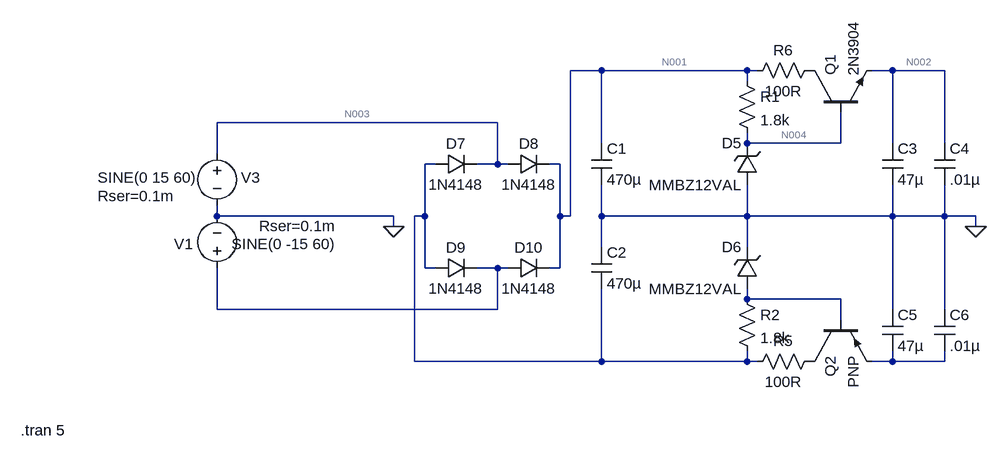
[diagram p0: schematic Mu-Tron Phasor II Power Supply.asc]
Mu-Tron Phasor II Power Supply.asc, the LTspice schematic file:
Version 4
SHEET 1 1000 680
WIRE -48 0 -96 0
WIRE 176 0 -48 0
WIRE 192 0 176 0
WIRE 400 0 368 0
WIRE 480 0 400 0
WIRE 176 16 176 0
WIRE -208 80 -640 80
WIRE -48 112 -48 0
WIRE 176 112 176 96
WIRE 320 112 320 64
WIRE 320 112 176 112
WIRE 400 112 400 0
WIRE 480 112 480 0
WIRE -640 128 -640 80
WIRE -304 144 -320 144
WIRE -208 144 -208 80
WIRE -208 144 -240 144
WIRE -192 144 -208 144
WIRE -112 144 -128 144
WIRE -640 224 -640 208
WIRE -368 224 -640 224
WIRE -320 224 -320 144
WIRE -320 224 -336 224
WIRE -112 224 -112 144
WIRE -96 224 -96 0
WIRE -96 224 -112 224
WIRE -48 224 -48 176
WIRE 176 224 176 176
WIRE 176 224 -48 224
WIRE 400 224 400 176
WIRE 400 224 176 224
WIRE 480 224 480 176
WIRE 480 224 400 224
WIRE 528 224 480 224
WIRE -368 240 -368 224
WIRE 528 240 528 224
WIRE -48 272 -48 224
WIRE 176 272 176 224
WIRE -320 304 -320 224
WIRE -304 304 -320 304
WIRE -208 304 -240 304
WIRE -192 304 -208 304
WIRE -112 304 -112 224
WIRE -112 304 -128 304
WIRE 176 352 176 336
WIRE 320 352 176 352
WIRE -640 368 -640 304
WIRE -208 368 -208 304
WIRE -208 368 -640 368
WIRE 400 368 400 224
WIRE 480 368 480 224
WIRE 320 384 320 352
WIRE -336 448 -336 224
WIRE -48 448 -48 336
WIRE -48 448 -336 448
WIRE 176 448 176 432
WIRE 176 448 -48 448
WIRE 192 448 176 448
WIRE 400 448 400 432
WIRE 400 448 368 448
WIRE 480 448 480 432
WIRE 480 448 400 448
FLAG -368 240 0
FLAG 528 240 0
SYMBOL cap -64 112 R0
SYMATTR InstName C1
SYMATTR Value 470µ
SYMBOL cap -64 272 R0
SYMATTR InstName C2
SYMATTR Value 470µ
SYMBOL zener 192 176 R180
WINDOW 0 24 64 Left 2
WINDOW 3 24 0 Left 2
SYMATTR InstName D5
SYMATTR Value MMBZ12VAL
SYMATTR Description Diode
SYMATTR Type diode
SYMBOL res 160 0 R0
SYMATTR InstName R1
SYMATTR Value 1.8k
SYMBOL zener 192 336 R180
WINDOW 0 24 64 Left 2
WINDOW 3 24 0 Left 2
SYMATTR InstName D6
SYMATTR Value MMBZ12VAL
SYMATTR Description Diode
SYMATTR Type diode
SYMBOL res 160 336 R0
SYMATTR InstName R2
SYMATTR Value 1.8k
SYMBOL voltage -640 112 R0
WINDOW 0 37 53 Left 2
WINDOW 3 -184 53 Left 2
WINDOW 123 0 0 Left 0
WINDOW 39 -184 81 Left 2
SYMATTR InstName V3
SYMATTR Value SINE(0 15 60)
SYMATTR SpiceLine Rser=0.1m
SYMBOL diode -304 160 R270
WINDOW 0 32 32 VTop 2
WINDOW 3 0 32 VBottom 2
SYMATTR InstName D7
SYMATTR Value 1N4148
SYMBOL diode -192 160 R270
WINDOW 0 32 32 VTop 2
WINDOW 3 0 32 VBottom 2
SYMATTR InstName D8
SYMATTR Value 1N4148
SYMBOL diode -304 320 R270
WINDOW 0 32 32 VTop 2
WINDOW 3 0 32 VBottom 2
SYMATTR InstName D9
SYMATTR Value 1N4148
SYMBOL diode -192 320 R270
WINDOW 0 32 32 VTop 2
WINDOW 3 0 32 VBottom 2
SYMATTR InstName D10
SYMATTR Value 1N4148
SYMBOL npn 272 64 R270
SYMATTR InstName Q1
SYMATTR Value 2N3904
SYMBOL cap 384 112 R0
SYMATTR InstName C3
SYMATTR Value 47µ
SYMBOL cap 464 112 R0
SYMATTR InstName C4
SYMATTR Value .01µ
SYMBOL cap 384 368 R0
SYMATTR InstName C5
SYMATTR Value 47µ
SYMBOL cap 464 368 R0
SYMATTR InstName C6
SYMATTR Value .01µ
SYMBOL pnp 272 384 M90
SYMATTR InstName Q2
SYMBOL res 288 432 R90
WINDOW 0 0 56 VBottom 2
WINDOW 3 32 56 VTop 2
SYMATTR InstName R5
SYMATTR Value 100R
SYMBOL res 288 -16 R90
WINDOW 0 0 56 VBottom 2
WINDOW 3 32 56 VTop 2
SYMATTR InstName R6
SYMATTR Value 100R
SYMBOL voltage -640 320 R180
WINDOW 0 37 53 Left 2
WINDOW 3 -184 53 Left 2
WINDOW 123 0 0 Left 0
WINDOW 39 -184 81 Left 2
SYMATTR InstName V1
SYMATTR Value SINE(0 -15 60)
SYMATTR SpiceLine Rser=0.1m
TEXT -942 554 Left 2 !.tran 5

The netlist it stands for:
* Mu-Tron Phasor II Power Supply.asc
C1 N001 0 470µ
C2 0 N005 470µ
D5 0 N004 MMBZ12VAL
R1 N001 N004 1.8k
D6 N007 0 MMBZ12VAL
R2 N007 N005 1.8k
V3 N003 0 SINE(0 15 60) Rser=0.1m
D7 N005 N003 1N4148
D8 N003 N001 1N4148
D9 N005 N006 1N4148
D10 N006 N001 1N4148
Q1 P001 N004 N002 0 2N3904
C3 N002 0 47µ
C4 N002 0 .01µ
C5 0 N008 47µ
C6 0 N008 .01µ
Q2 P002 N007 N008 0 PNP
R5 P002 N005 100R
R6 P001 N001 100R
V1 N006 0 SINE(0 -15 60) Rser=0.1m
.model D D
.lib standard.dio
.model NPN NPN
.model PNP PNP
.lib standard.bjt
.tran 5
.backanno
.end

* Results of the author's LTspice run, read from the files saved beside the schematic
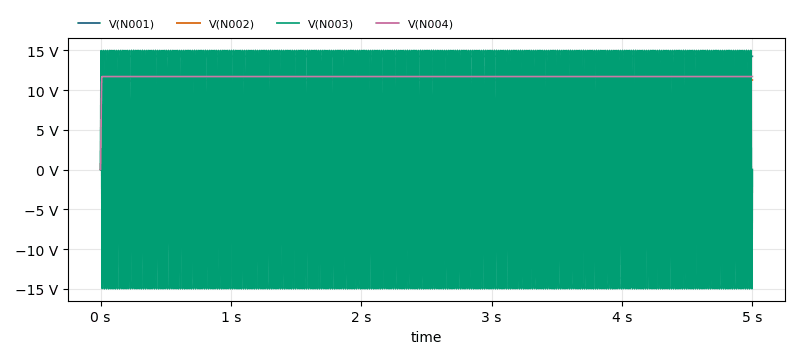
[diagram p1: Transient Analysis of Mu-Tron Phasor II Power Supply.asc, plotted from the saved traces]
* Transient Analysis, 1 run:
*   V(N001): min 0 V, max 14.26 V, average 14.24 V, rms 14.24 V, last 14.25 V
*   V(N002): min 0 V, max 11.27 V, average 11.23 V, rms 11.23 V, last 11.27 V
*   V(N003): min -15 V, max 15 V, average 247 µV, rms 10.8 V, last 0 V
*   V(N004): min 0 V, max 11.7 V, average 11.69 V, rms 11.7 V, last 11.7 V